# EAGLE design Lipo-Charger-5V-setup_RevB (EAGLE 8.2.1)
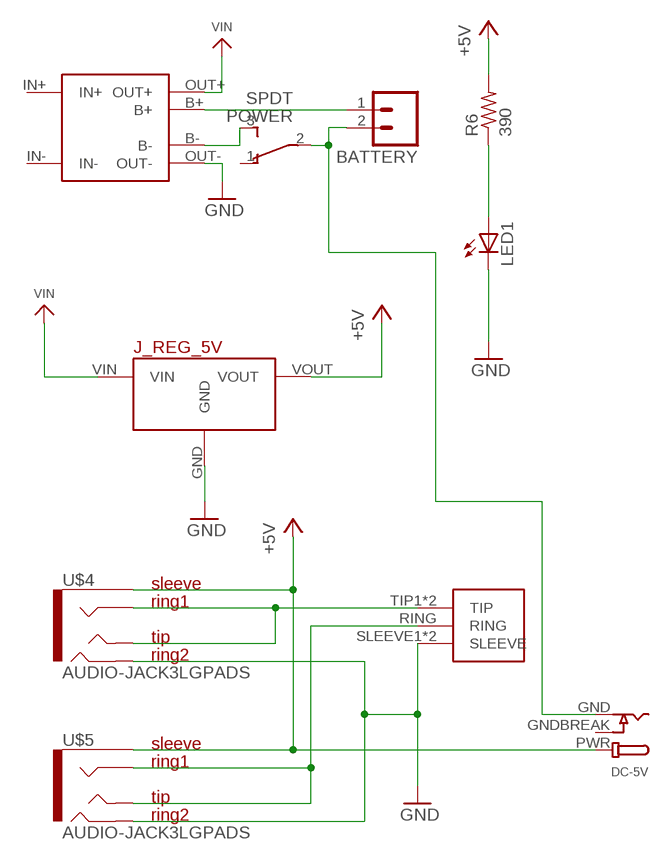
[diagram p0: schematic, sheet 1]

## Parts
AUDIO_OUT  1/8"-F-STEREO-PCB  [1/8"-F-STEREO-PCB]
BATTERY  M02LOCK  [1X02_LOCK]
DC-5V  DCBARRELPTH  [DCJACK_2MM_PTH]
J_REG_5V  POLOLU_VOLTAGE_REGULATORS_3PIN  [POLOLU_5V-12V_STEPUP_U3V12F5-U3V12F12]
LED1  LED3MM  [LED3MM]
POWER  SPDT  SWITCH_SPDTTE-CONNECT  [SWITCH_SPDT-TE-CONNECT]
R6  390  R-US_0204/7  [0204/7]
U$4  AUDIO-JACK3LGPADS  [AUDIO-JACK-TRRS-SMD]
U$5  AUDIO-JACK3LGPADS  [AUDIO-JACK-TRRS-SMD]
USB-LIPO-CHARGER  TP4056-MODULE  [TP4056-LITHIUM-PROTECTED-MODULE]

## Nets
+5V: DC-5V.PWR J_REG_5V.VOUT R6.2 U$4.EARTH U$5.EARTH
GND: AUDIO_OUT.SLEEVE1(SLEEVE) AUDIO_OUT.SLEEVE2(SLEEVE) J_REG_5V.GND LED1.K(C) U$4.RING2 U$5.RING2 USB-LIPO-CHARGER.OUT-
N$1: BATTERY.2 DC-5V.GND POWER.2
N$2: LED1.A R6.1
N$3: POWER.3 USB-LIPO-CHARGER.B-
N$8: AUDIO_OUT.RING U$5.RING1 U$5.TIP
N$18: BATTERY.1 USB-LIPO-CHARGER.B+
OUT2: AUDIO_OUT.TIP1(TIP) AUDIO_OUT.TIP2(TIP) U$4.RING1 U$4.TIP
VIN: J_REG_5V.VIN USB-LIPO-CHARGER.OUT+
Unconnected: POWER.1

## Power pins joined to a net without a drawn wire
GNDBREAK: DC-5V.GNDBREAK
IN+: USB-LIPO-CHARGER.IN+
IN-: USB-LIPO-CHARGER.IN-

## Library data of the parts
AUDIO_OUT = CMU-ArtFab:1/8"-F-STEREO-PCB
BATTERY = CMU-ArtFab:M02: Header 2 Standard 2-pin 0.1" header. Use with straight break away headers (SKU : PRT-00116), right angle break away headers (PRT-00553), swiss pins (PRT-00743), machine pins (PRT-00117), and female headers (PRT-00115). Molex polarized connector foot print use with SKU : PRT-08233 with associated crimp pins and housings.
DC-5V = microbuilder:DCBARREL: DC Barrel Jack DCJACK_1.3MM_PTH - Through Hole 1.3mm Jack (4UConnector: 05536) DCJACK_2MM_PTH - Through Hole 2.0/2.1 Jack (4UConnector: 05537) DCJACK_2MM_SMT - SMT 2.0/2.1mm Jack(4UConnector: 03267)
J_REG_5V = CMU-ArtFab:POLOLU_VOLTAGE_REGULATORS_3PIN: Polulu 5V Step-Up/Step-Down Voltage REgulator S7V7F5
LED1 = led:LED: LED OSRAM: - CHIPLED LG R971, LG N971, LY N971, LG Q971, LY Q971, LO R971, LY R971 LH N974, LH R974 LS Q976, LO Q976, LY Q976 LO Q996 - Hyper CHIPLED LW Q18S LB Q993, LB Q99A, LB R99A - SideLED LS A670, LO A670, LY A670, LG A670, LP A670 LB A673, LV A673, LT A673, LW A673 LH A674 LY A675 LS A676, LA A676, LO A676, LY A676, LW A676 LS A679, LY A679, LG A679 - Hyper Micro SIDELED® LS Y876, LA Y876, LO Y876, LY Y876 LT Y87S - SmartLED LW L88C, LW L88S LB L89C, LB L89S, LG L890 LS L89K, LO L89K, LY L89K LS L896, LA L896, LO L896, LY L896 - TOPLED LS T670, LO T670, LY T670, LG T670, LP T670 LSG T670, LSP T670, LSY T670, LOP T670, LYG T670 LG T671, LOG T671, LSG T671 LB T673, LV T673, LT T673, LW T673 LH T674 LS T676, LA T676, LO T676, LY T676, LB T676, LH T676, LSB T676, LW T676 LB T67C, LV T67C, LT T67C, LS T67K, LO T67K, LY T67K, LW E67C LS E67B, LA E67B, LO E67B, LY E67B, LB E67C, LV E67C, LT E67C LW T67C LS T679, LY T679, LG T679 LS T770, LO T770, LY T770, LG T770, LP T770 LB T773, LV T773, LT T773, LW T773 LH T774 LS E675, LA E675, LY E675, LS T675 LS T776, LA T776, LO T776, LY T776, LB T776 LHGB T686 LT T68C, LB T68C - Hyper Mini TOPLED® LB M676 - Mini TOPLED Santana® LG M470 LS M47K, LO M47K, LY M47K Source: http://www.osram.convergy.de LUXEON: - LUMILED® LXK2-PW12-R00, LXK2-PW12-S00, LXK2-PW14-U00, LXK2-PW14-V00 LXK2-PM12-R00, LXK2-PM12-S00, LXK2-PM14-U00 LXK2-PE12-Q00, LXK2-PE12-R00, LXK2-PE12-S00, LXK2-PE14-T00, LXK2-PE14-U00 LXK2-PB12-K00, LXK2-PB12-L00, LXK2-PB12-M00, LXK2-PB14-N00, LXK2-PB14-P00, LXK2-PB14-Q00 LXK2-PR12-L00, LXK2-PR12-M00, LXK2-PR14-Q00, LXK2-PR14-R00 LXK2-PD12-Q00, LXK2-PD12-R00, LXK2-PD12-S00 LXK2-PH12-R00, LXK2-PH12-S00 LXK2-PL12-P00, LXK2-PL12-Q00, LXK2-PL12-R00 Source: www.luxeon.com KINGBRIGHT: KA-3528ASYC Source: www.kingbright.com
POWER = CMU-ArtFab:SWITCH_SPDT
R6 = CMU-ArtFab:R-US_: RESISTOR, American symbol
U$4 U$5 = CMU-ArtFab:AUDIO-JACK3: Audio jack - 3.5mm TRRS variety - two rings.
USB-LIPO-CHARGER = CMU-ArtFab:TP4056-MODULE

## Board
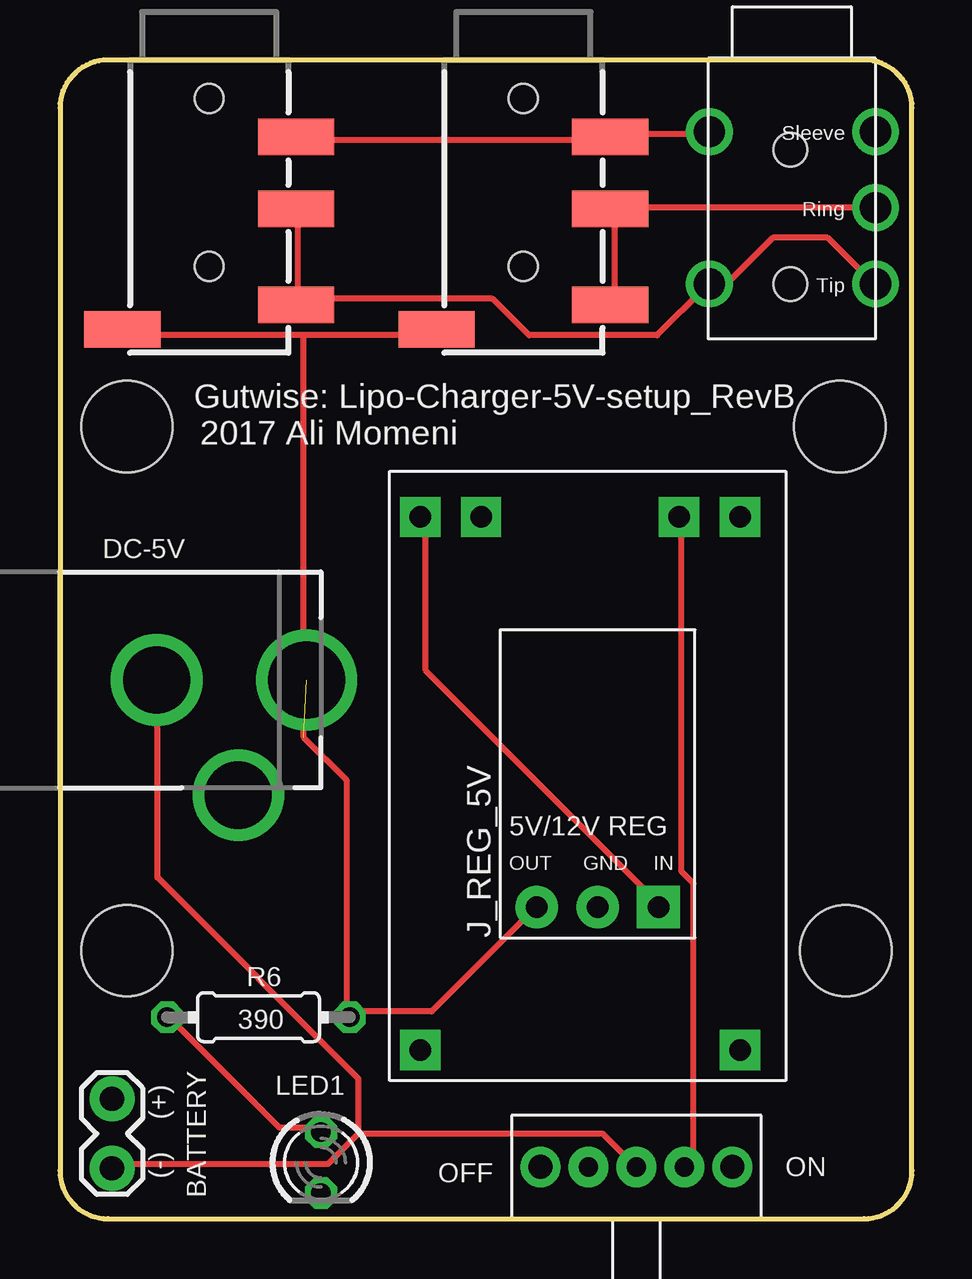
[diagram p1: board, top side]
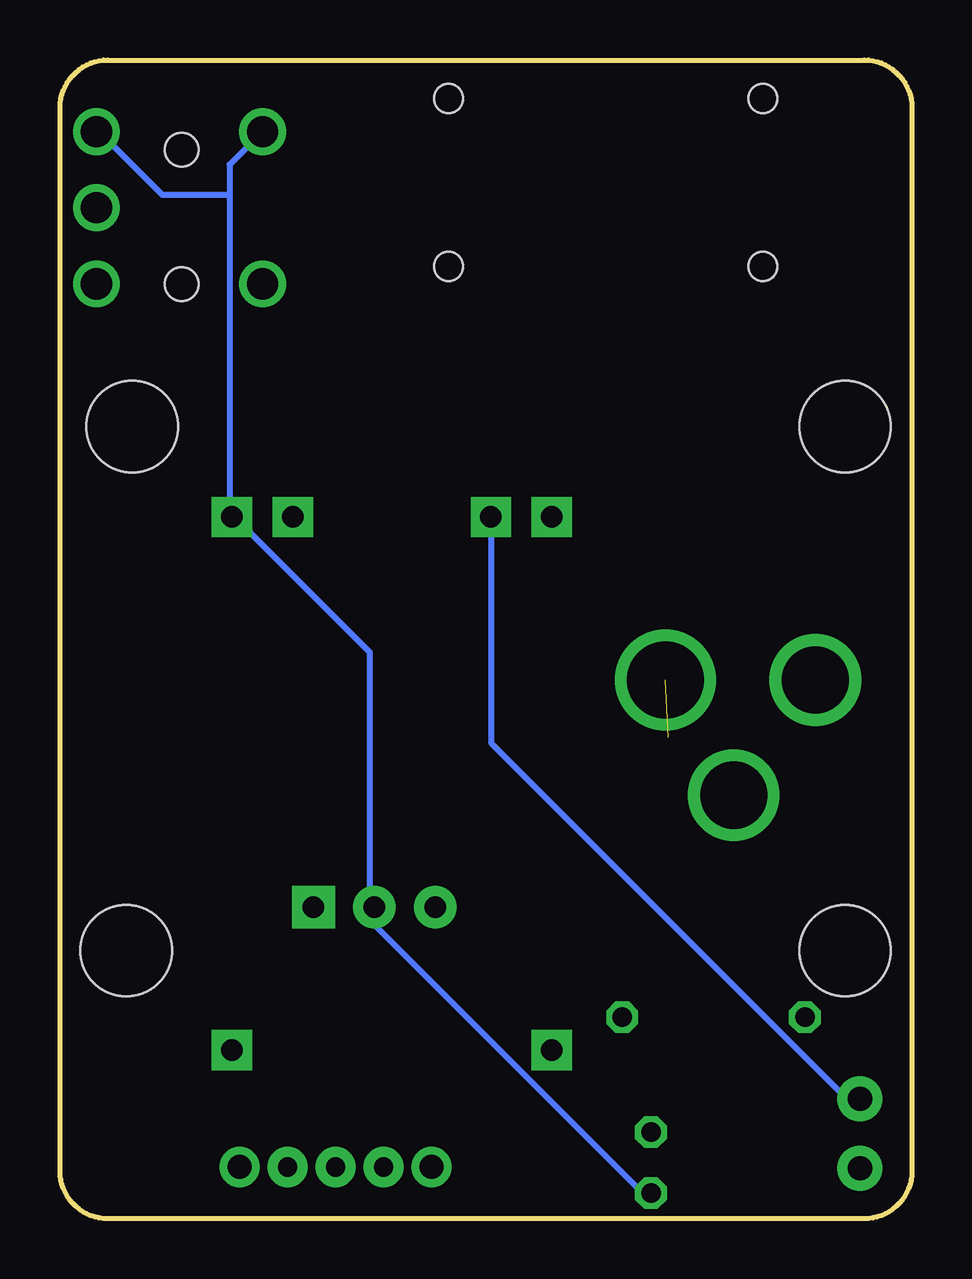
[diagram p2: board, bottom side, seen from below]

Size 35.52 x 48.3 mm. Coordinates in mm from the lower left corner, seen from the top.
Outline: 0,2 arc90 2,0 33.52,0 arc90 35.52,2 35.52,46.3 arc90 33.52,48.3 2,48.3 arc90 0,46.3 0,2
Copper layers (1*16): Top 0.035mm / dielectric 1.5mm / Bottom 0.035mm
Design rules "default *": minimum track width 10mil, minimum drill 24mil, track to track 10mil, track to pad 10mil, pad to pad 10mil, via to via 10mil, smd to smd 8mil, copper to edge 40mil, drill to drill 8mil, minimum pad ring 10mil, minimum via ring 8mil, stop-mask expansion 4mil, vias tented up to drill 0mil, thermal gap 10mil
Holes 3.81 mm at 2.79,33.02 32.51,33.02 32.77,11.18 2.79,11.18

### Footprints (pad centres in the part's own frame; a part is rotated, then mirrored left to right if it is on the bottom)
1/8"-F-STEREO-PCB = drill 1.3: RING 5.461,0; SLEEVE1 8.636,6.934; SLEEVE2 8.636,0; TIP1 2.286,6.934; TIP2 2.286,0 | hole 1.4: 2.286,3.556; 7.874,3.556
1X02_LOCK = drill 1.016 pad 1.88: 1 -0.178,0; 2 2.718,0
DCJACK_2MM_PTH = drill 2.8: GND 0,7.35; GNDBREAK 4.8,10.75 | drill 3.2: PWR 0,13.6
POLOLU_5V-12V_STEPUP_U3V12F5-U3V12F12 = drill 0.9 pad 1.778: GND 0,-6.35; VOUT -2.54,-6.35 | drill 0.9 pad 1.778 square: VIN 2.54,-6.35
LED3MM = drill 0.813 octagon: A -1.27,0; K 1.27,0
SWITCH_SPDT-TE-CONNECT = drill 0.8 pad 1.676: 1 2,0; 2 4,0; 3 6,0 | drill 1 pad 1.676: MOUNT1 0,0; MOUNT2 8,0
0204/7 = drill 0.813 octagon: 1 -3.81,0; 2 3.81,0
AUDIO-JACK-TRRS-SMD = smd 1.524 x 3.175: EARTH 11.227,-3.619; RING1 6.2,3.619; RING2 3.2,3.619; TIP 10.2,3.619 | hole 1.2: 1.6,0; 8.6,0
TP4056-LITHIUM-PROTECTED-MODULE = drill 0.9 pad 1.676 square: B+ 10.795,4.445; B- 10.795,-3.81; IN+ -11.43,6.985; IN- -11.43,-6.35; OUT+ 10.795,6.985; OUT- 10.795,-6.35

### Placement (x,y rotation side)
AUDIO_OUT  34,36.68 90 top
BATTERY  2.17,4.82 270 top
DC-5V  -3.32,22.46 270 top
J_REG_5V  22.41,19.34 0 top
LED1  10.88,2.34 270 top
POWER  20.03,2.16 0 top
R6  8.27,8.4 0 top
U$4  6.22,48.3 270 top
U$5  19.32,48.3 270 top
USB-LIPO-CHARGER  22,18.46 90 top

### Tracks (layer width: path | path; a pad name or v marks a point on that pad's centre or on a via)
+5V  (2 unrouted)
  Top 0.254: 10.16,36.83 15.49,36.83 U$5.EARTH | 10.16,36.83 2.79,36.83 U$4.EARTH | J_REG_5V.VOUT 19.81,12.95 15.49,8.64 12.19,8.64 R6.2 11.94,8.64 11.94,18.29 10.16,20.07 10.16,36.83
GND
  Top 0.254: U$4.RING2 9.91,44.96 22.86,44.96 U$5.RING2 23.11,45.21 26.92,45.21 AUDIO_OUT.SLEEVE1
  Bottom 0.254: LED1.K 10.92,1.27 11.43,1.27 22.35,12.19 22.35,12.95 J_REG_5V.GND 22.61,13.21 22.61,23.62 28.19,29.21 USB-LIPO-CHARGER.OUT- 28.45,29.46 28.45,42.67 | 28.45,42.67 28.45,43.94 27.18,45.21 AUDIO_OUT.SLEEVE1 | 28.45,42.67 31.24,42.67 33.78,45.21 AUDIO_OUT.SLEEVE2
N$1
  Top 0.254: 12.45,3.56 22.61,3.56 23.88,2.29 POWER.2 | 12.45,3.56 11.18,2.29 2.29,2.29 BATTERY.2 | 12.45,3.56 12.45,5.84 4.06,14.22 4.06,19.81 DC-5V.GND
N$2
  Top 0.254: LED1.A 10.67,3.81 9.14,3.81 4.57,8.38 R6.1
N$3
  Top 0.254: USB-LIPO-CHARGER.B- 25.91,29.21 25.91,14.48 26.42,13.97 26.42,2.54 26.16,2.29 POWER.3
N$8
  Top 0.254: U$5.TIP 23.11,38.35 23.11,41.91 U$5.RING1 23.11,42.16 33.78,42.16 AUDIO_OUT.RING
N$18
  Bottom 0.254: USB-LIPO-CHARGER.B+ 17.53,29.21 17.53,19.81 2.79,5.08 2.29,5.08 BATTERY.1
OUT2
  Top 0.254: 9.91,38.35 9.91,41.91 U$4.RING1 | AUDIO_OUT.TIP2 33.78,39.12 32,40.89 29.72,40.89 27.94,39.12 27.18,39.12 AUDIO_OUT.TIP1 26.92,38.86 24.89,36.83 19.56,36.83 18.03,38.35 9.91,38.35 | 9.91,38.35 U$4.TIP
VIN
  Top 0.254: USB-LIPO-CHARGER.OUT+ 15.24,29.21 15.24,22.86 24.89,13.21 J_REG_5V.VIN

### Text on the board
tNames: Gutwise: Lipo-Charger-5V-setup_RevB | 2017 Ali Momeni | OFF | ON